# Altium schematic sheet Stepper Motor Driver.SchDoc: Stepper Motor Driver
size Tabloid; DocumentNumber: LM-004; Revision: C; SheetNumber: 3; SheetTotal: 3
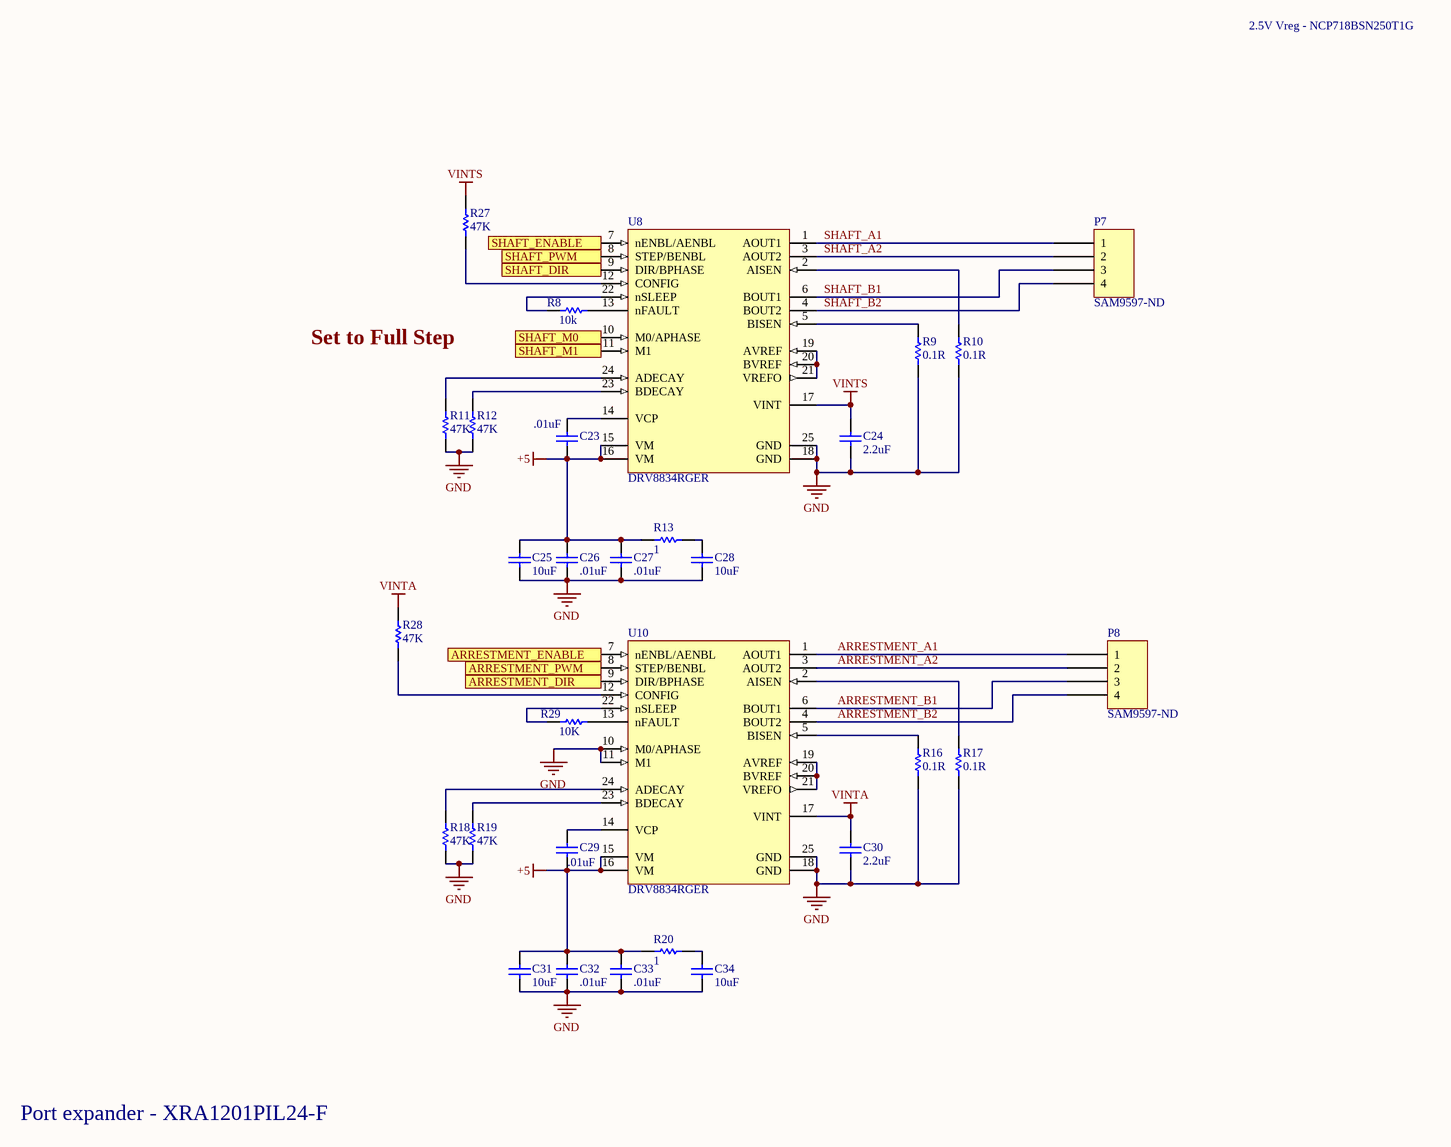
[diagram p0: Stepper Motor Driver.SchDoc]

## Parts
C23  .01uF  [CAPC0402(1005)60_N]
C24  2.2uF  [CAPC0402(1005)60_N]
C25  10uF  [CAPC0402(1005)60_N]
C26  .01uF  [CAPC0402(1005)60_N]
C27  .01uF  [CAPC0402(1005)60_N]
C28  10uF  [CAPC0402(1005)60_N]
C29  .01uF  [CAPC0402(1005)60_N]
C30  2.2uF  [CAPC0402(1005)60_N]
C31  10uF  [CAPC0402(1005)60_N]
C32  .01uF  [CAPC0402(1005)60_N]
C33  .01uF  [CAPC0402(1005)60_N]
C34  10uF  [CAPC0402(1005)60_N]
P7  Supplier Part Number 1: SAM9597-ND  [IPL1-104-01-L-S-RA-K]  (hidden comment: IPL1-104-01-L-S-RA-K)
P8  Supplier Part Number 1: SAM9597-ND  [IPL1-104-01-L-S-RA-K]  (hidden comment: IPL1-104-01-L-S-RA-K)
R8  10k  [RESC0402(1005)_M]
R9  0.1R  [RESC0402(1005)_M]
R10  0.1R  [RESC0402(1005)_M]
R11  47K  [RESC0402(1005)_M]
R12  47K  [RESC0402(1005)_M]
R13  1  [RESC0402(1005)_M]
R16  0.1R  [RESC0402(1005)_M]
R17  0.1R  [RESC0402(1005)_M]
R18  47K  [RESC0402(1005)_M]
R19  47K  [RESC0402(1005)_M]
R20  1  [RESC0402(1005)_M]
R27  47K  [RESC0402(1005)_M]
R28  47K  [RESC0402(1005)_M]
R29  10K  [RESC0402(1005)_M]
U8  DRV8834RGER  [RGE0024B_V]
U10  DRV8834RGER  [RGE0024B_V]

## Ports
ARRESTMENT_DIR, ARRESTMENT_ENABLE, ARRESTMENT_PWM, SHAFT_DIR, SHAFT_ENABLE, SHAFT_M0, SHAFT_M1, SHAFT_PWM

## Nets
+5: C23.1 C25.2 C26.2 C27.2 C29.1 C31.2 C32.2 C33.2 R13.1 R20.1 U8.15(VM) U8.16(VM) U10.15(VM) U10.16(VM)
GND: C24.1 C25.1 C26.1 C27.1 C28.1 C30.1 C31.1 C32.1 C33.1 C34.1 R9.2 R10.2 R11.2 R12.2 R16.2 R17.2 R18.2 R19.2 U8.18(GND) U8.25(GND) U10.10(M0/APHASE) U10.11(M1) U10.18(GND) U10.25(GND)
VINTA: C30.2 R28.1 U10.17(VINT)
VINTS: C24.2 R27.1 U8.17(VINT)
ARRESTMENT_A1: P8.1 U10.1(AOUT1)
ARRESTMENT_A2: P8.2 U10.3(AOUT2)
ARRESTMENT_B1: P8.3 U10.6(BOUT1)
ARRESTMENT_B2: P8.4 U10.4(BOUT2)
ARRESTMENT_DIR: U10.9(DIR/BPHASE) ; port ARRESTMENT_DIR
ARRESTMENT_ENABLE: U10.7(nENBL/AENBL) ; port ARRESTMENT_ENABLE
ARRESTMENT_PWM: U10.8(STEP/BENBL) ; port ARRESTMENT_PWM
SHAFT_A1: P7.1 U8.1(AOUT1)
SHAFT_A2: P7.2 U8.3(AOUT2)
SHAFT_B1: P7.3 U8.6(BOUT1)
SHAFT_B2: P7.4 U8.4(BOUT2)
SHAFT_DIR: U8.9(DIR/BPHASE) ; port SHAFT_DIR
SHAFT_ENABLE: U8.7(nENBL/AENBL) ; port SHAFT_ENABLE
SHAFT_M0: U8.10(M0/APHASE) ; port SHAFT_M0
SHAFT_M1: U8.11(M1) ; port SHAFT_M1
SHAFT_PWM: U8.8(STEP/BENBL) ; port SHAFT_PWM
NetC23_2: C23.2 U8.14(VCP)
NetC28_2: C28.2 R13.2
NetC29_2: C29.2 U10.14(VCP)
NetC34_2: C34.2 R20.2
NetR8_1: R8.1 U8.22(nSLEEP)
NetR8_2: R8.2 U8.13(nFAULT)
NetR9_1: R9.1 U8.5(BISEN)
NetR10_1: R10.1 U8.2(AISEN)
NetR11_1: R11.1 U8.24(ADECAY)
NetR12_1: R12.1 U8.23(BDECAY)
NetR16_1: R16.1 U10.5(BISEN)
NetR17_1: R17.1 U10.2(AISEN)
NetR18_1: R18.1 U10.24(ADECAY)
NetR19_1: R19.1 U10.23(BDECAY)
NetR27_2: R27.2 U8.12(CONFIG)
NetR28_2: R28.2 U10.12(CONFIG)
NetR29_1: R29.1 U10.22(nSLEEP)
NetR29_2: R29.2 U10.13(nFAULT)
NetU8_19: U8.19(AVREF) U8.20(BVREF) U8.21(VREFO)
NetU10_19: U10.19(AVREF) U10.20(BVREF) U10.21(VREFO)

## Notes on the sheet
- 2.5V Vreg - NCP718BSN250T1G
- Set to Full Step
- Port expander - XRA1201PIL24-F
- Title
- Size:
- Date:
- Tabloid
- Number:
- Time:
- Revision:
- Sheet
- of
- ZLS Corporation
- 7801 North Lamar Blvd.
- Suite E-184
- Austin, Texas 78752  USA
- (512) 453-0288
- File:

## Library data of the parts
C23-C34 = CMP-1034-01365-1: CAP 220pF 25V ±10% 0402 (1005 Metric) Thickness 0.6mm SMD
R8-R13 R16-R20 R27-R29 = CMP-1011-00463-1
U8 U10 = CMP-1685-00004-1: Dual-Bridge Stepper or DC Motor Driver, 2.5 to 10.8 V, -40 to 85 degC, 24-pin QFN (RGE), Green (RoHS & no Sb/Br), Tape and Reel; Min Supply Voltage: 2.5 V; Output Current: 1.5 A; Nominal Supply Current: 4 mA; Max Operating Temperature: 85 degC; Pins: 24; Packaging: Tape and Reel; ComponentLink2Description: Datasheet; ComponentLink2URL: http://www.ti.com/general/docs/lit/getliterature.tsp?genericPartNumber=DRV8834&fileType=pdf; Mounting Technology: Surface Mount; ComponentLink1URL: http://www.ti.com/; Package Quantity: 3000; Mount: Surface Mount; Min Operating Temperature: -40 degC; RoHSCompliant: true; Radiation Hardening: No; PackageDescription: 24-Pin Quad Flat No-lead Package, Body 4 x 4 mm, Pitch 0.5 mm; DatasheetVersion: SLVSB19D, 03/2015; PackageReference: RGE0024B; ComponentLink1Description: Manufacturer URL
P7 P8 = IPL1-104-01-L-S-RA-K: Supplier 1: Digi-Key